# Altium schematic sheet mission_unsleepable.SchDoc
size A2
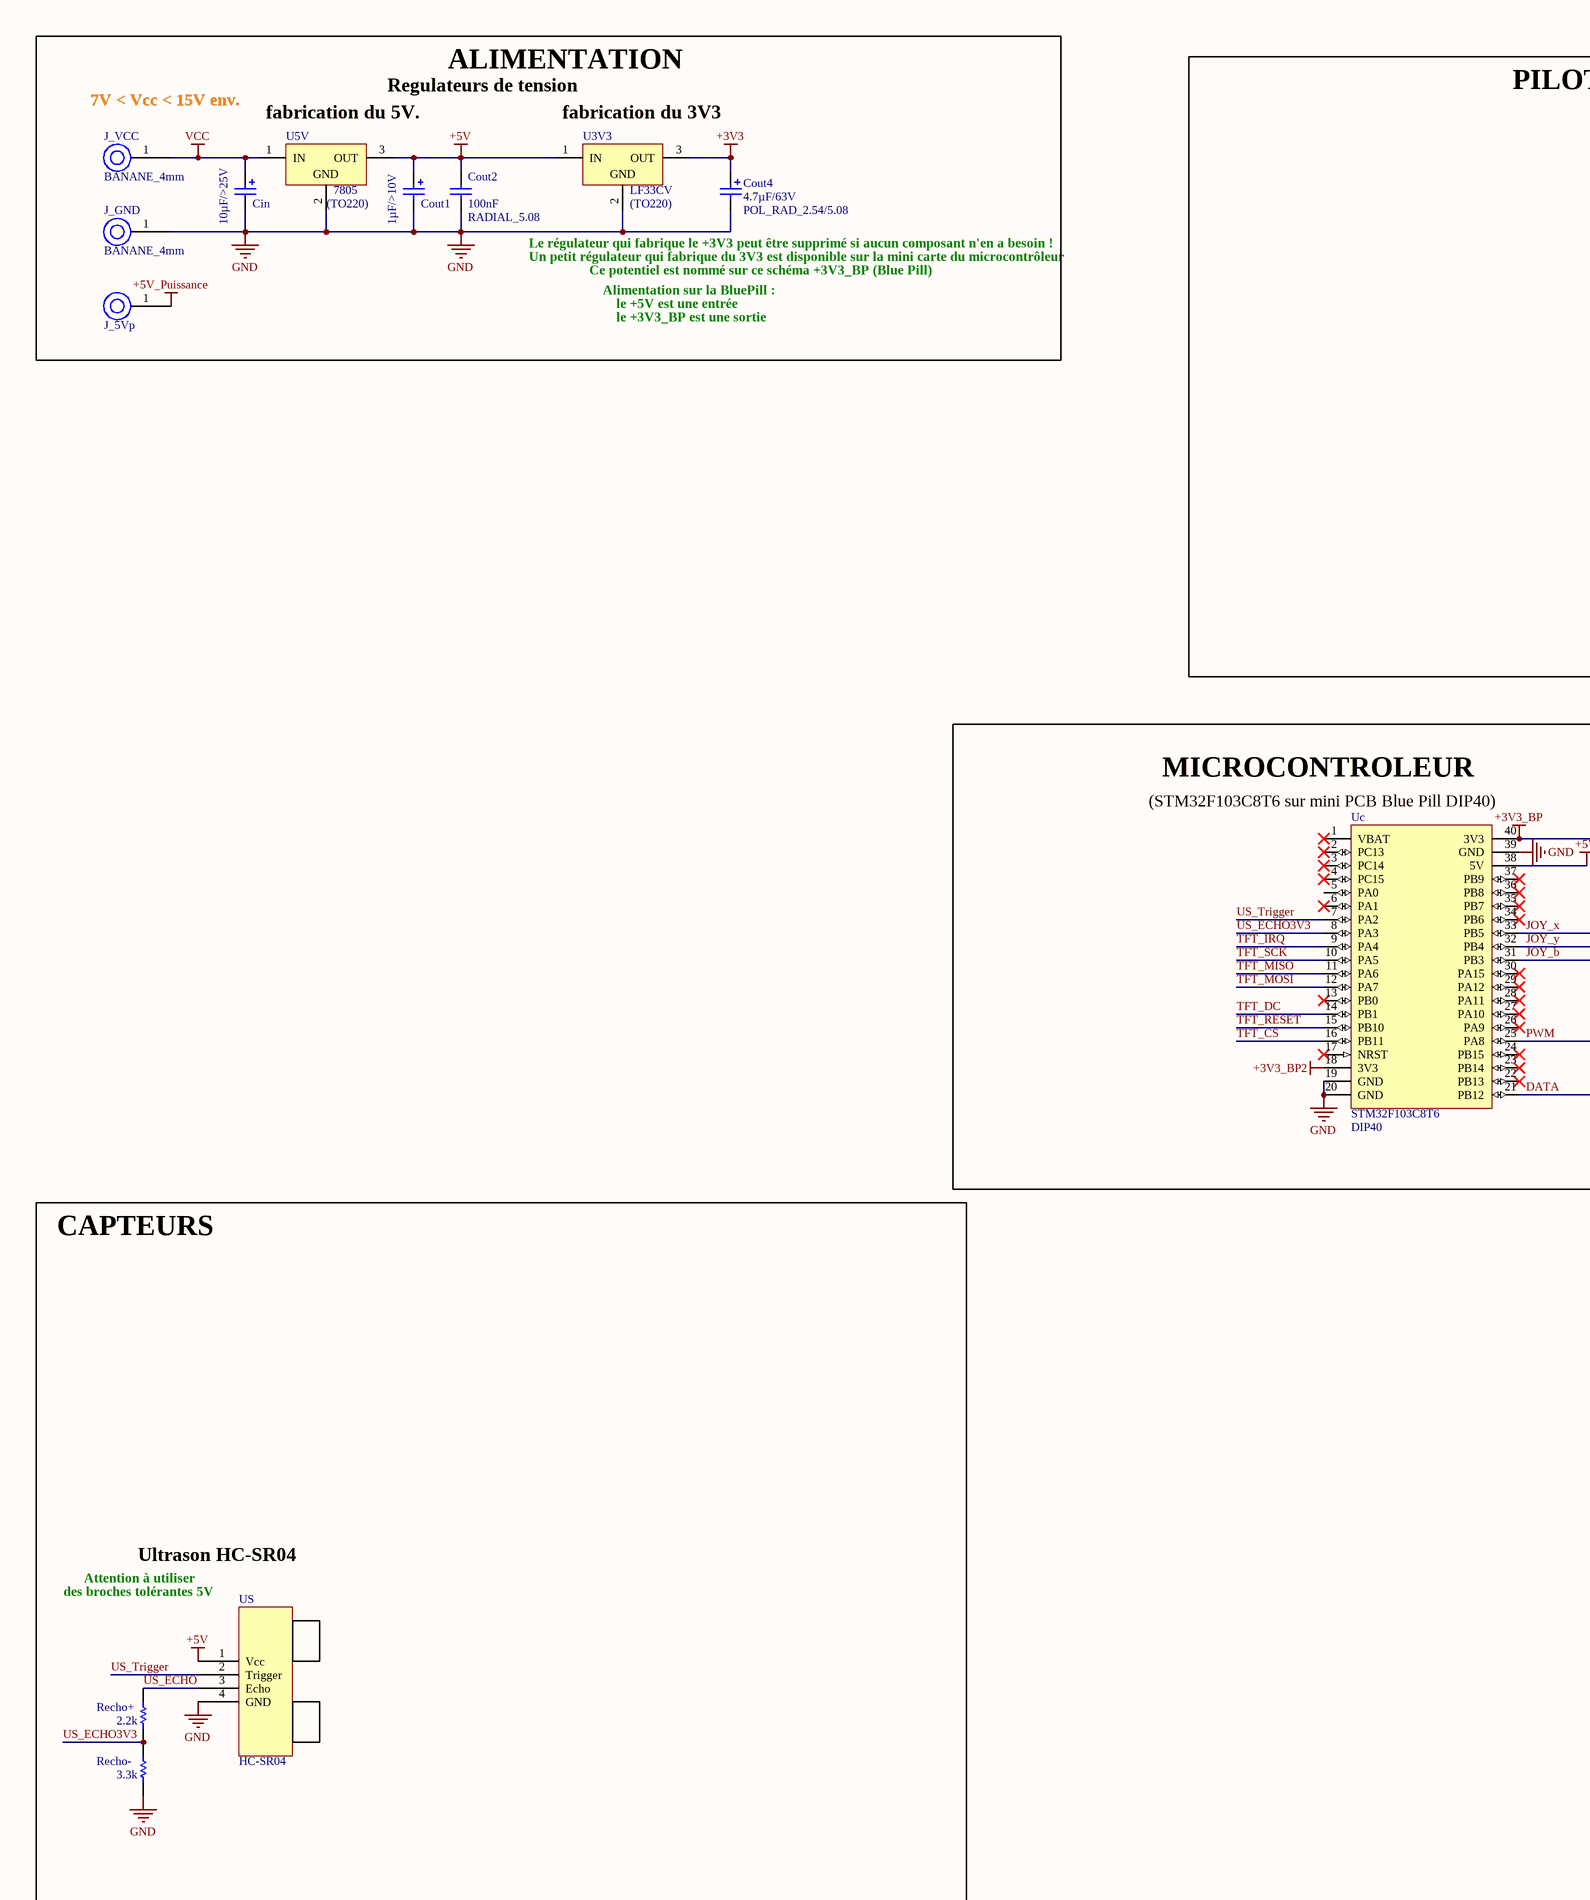
[diagram p0: mission_unsleepable.SchDoc, left]
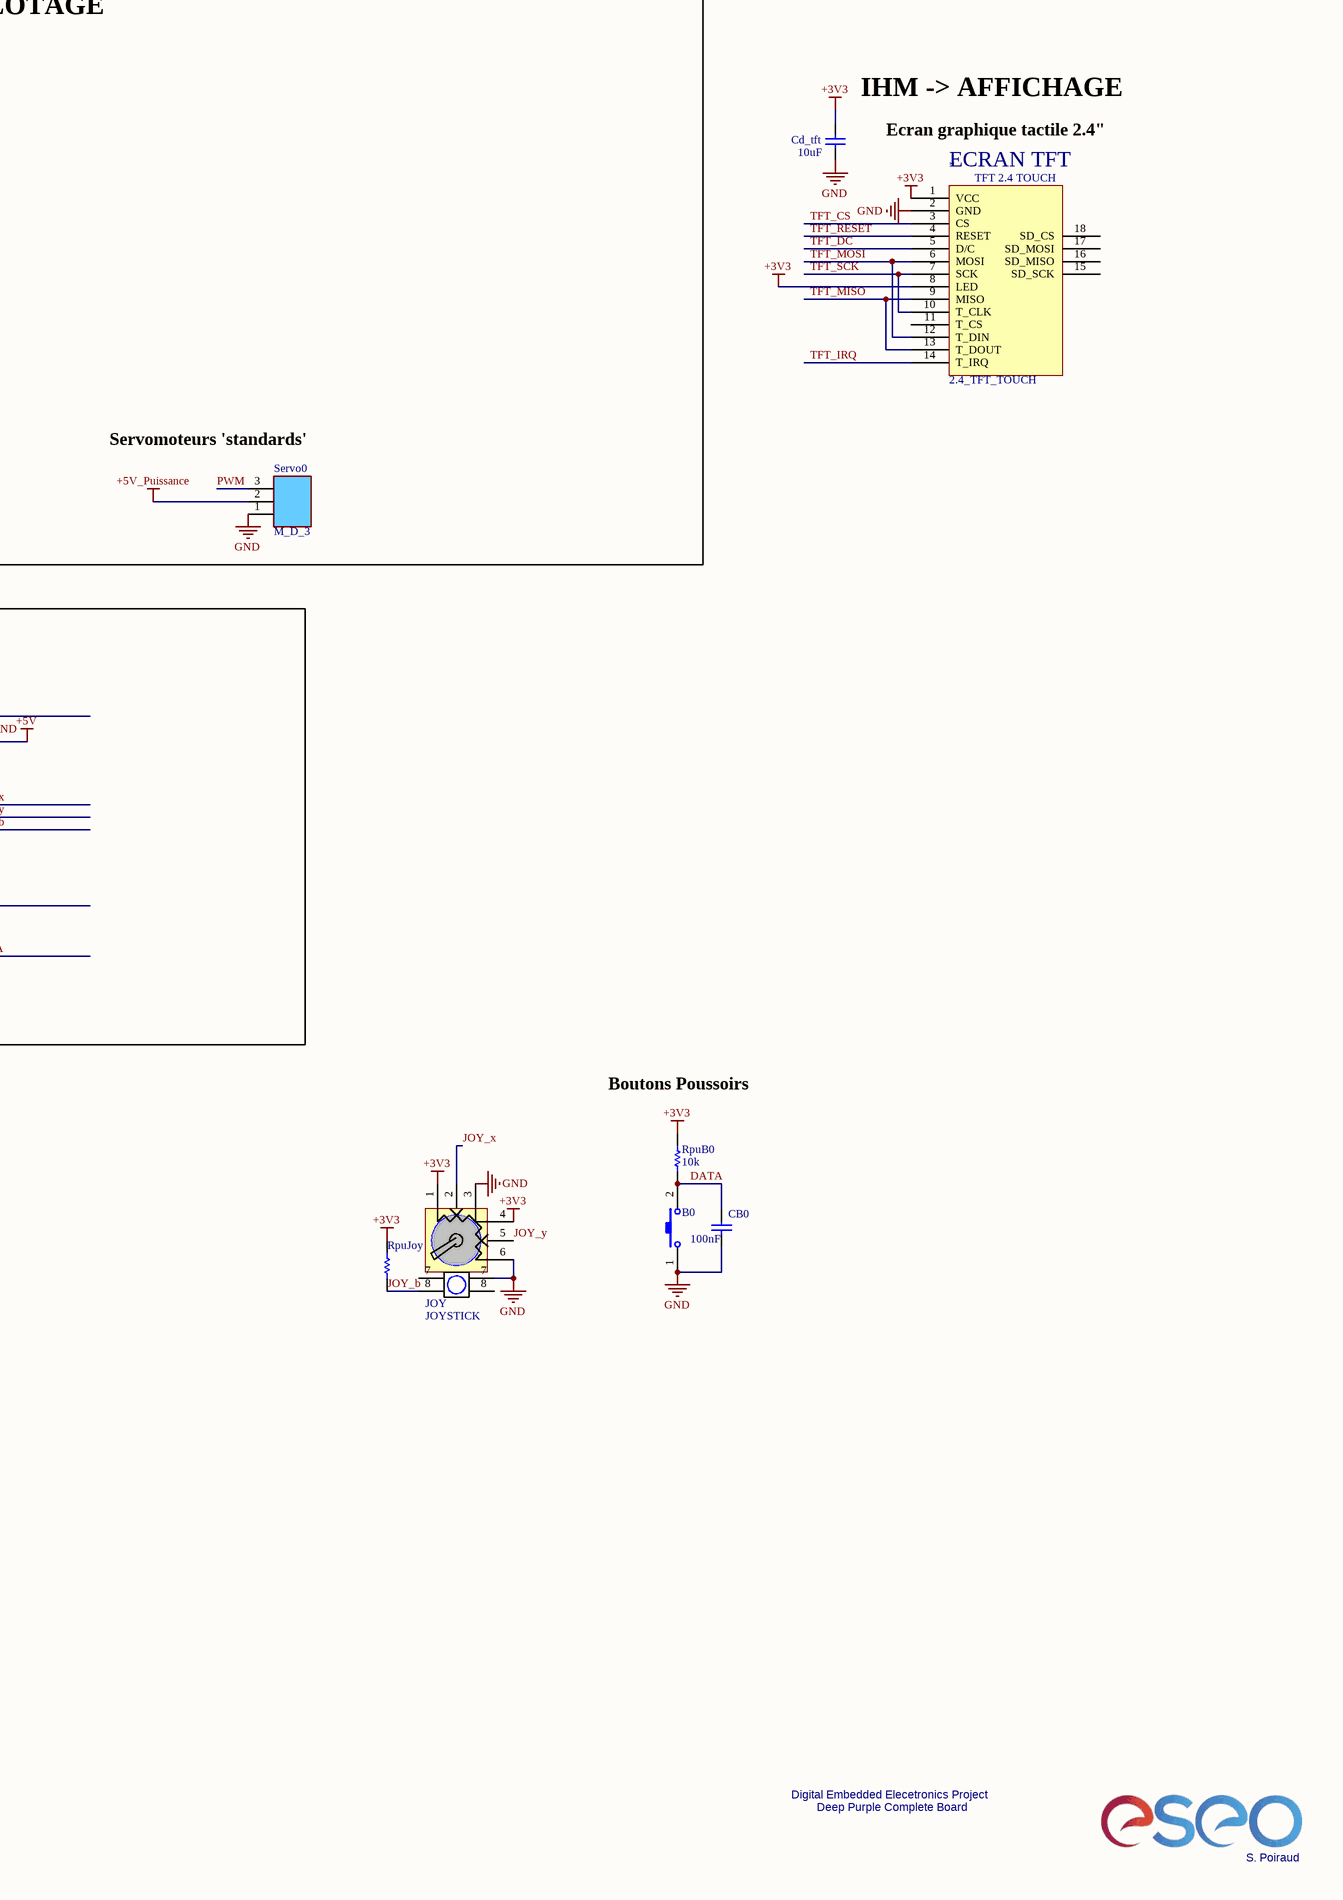
[diagram p1: mission_unsleepable.SchDoc, right]

## Parts
*  2.4_TFT_TOUCH  [2.4_TFT_TOUCH]
B0  BOUTON_POUSSOIR_MINIATURE_TRAVERSANT  [BOUTON_POUSSE_PLAT_6x6]  (value not drawn)
CB0  value 100nF  [C0805_N]  (hidden comment: Condensateur 0805)
Cd_tft  10uF  [CONDENSATEUR_POLARISE_ELECTROLYTIQUE_RADIAL_2.54/5.08]
Cin  value 10µF/>25V  [CONDENSATEUR_POLARISE_ELECTROLYTIQUE_RADIAL_2.0/5.08]  (hidden comment: CONDENSATEUR_POL_ELECTROLY_RAD_2.0/5.08)
Cout1  value 1µF/>10V  [CONDENSATEUR_POLARISE_ELECTROLYTIQUE_RADIAL_2.0/5.08]  (hidden comment: CONDENSATEUR_POL_ELECTROLY_RAD_2.0/5.08)
Cout2  value 100nF  Type: RADIAL_5.08  [CONDENSATEUR_CERAMIQUE_RADIAL_5.08]  (hidden comment: CONDENSATEUR_CER_RAD_5.08)
Cout4  value 4.7µF/63V  Type: POL_RAD_2.54/5.08  [CONDENSATEUR_POLARISE_ELECTROLYTIQUE_RADIAL_2.54/5.08]  (hidden comment: CONDENSATEUR_POL_ELECTROLY_RAD_2.54/5.08)
J_5Vp  DOUILLE BANANE 4mm  [DOUILLE_BANANE_4mm]  (value not drawn)
J_GND  Type: BANANE_4mm  [DOUILLE_BANANE_4mm]  (hidden comment: DOUILLE BANANE 4mm)
J_VCC  Type: BANANE_4mm  [DOUILLE_BANANE_4mm]  (hidden comment: DOUILLE BANANE 4mm)
JOY  Type: JOYSTICK  [JOYSTICK_MINI - avec Switch]  (hidden comment: JOYSTICK_MINI_AVEC_SWITCH)
Recho+  2.2k  [R1206_N]
Recho-  3.3k  [R1206_N]
RpuB0  value 10k  [RESISTANCE_CMS_1206]  (hidden comment: RESISTANCE_CMS_1206)
RpuJoy  RESISTANCE_CMS_1206  [RESISTANCE_CMS_1206]  (value not drawn)
Servo0  Type: M_D_3  [BARRETTE_3_M_D]  (hidden comment: BARRETTE 3 CONTACTS 1 RANGEE MALE DROITE)
U3V3  Type: LF33CV  Package: (TO220)  [REGULATEUR_TO220_78XX]  (hidden comment: REGULATEUR_TO220_78XX)
U5V  Type: 7805  Package: (TO220)  [REGULATEUR_TO220_78XX]  (hidden comment: REGULATEUR_TO220_78XX)
Uc  Type: STM32F103C8T6  Package: DIP40  [STM32F103C8T6_DIP40]  (hidden comment: STM32F103C8T6/PCB_DIP40)
US  HC-SR04  [HC-SR04]

## Blocks framed on the sheet
ALIMENTATION: Cin Cout1 Cout2 Cout4 J_5Vp J_GND J_VCC U3V3 U5V
MICROCONTROLEUR: Uc
CAPTEURS: Recho+ Recho- US

## Nets
+3V3: *.1(VCC) *.8(LED) Cd_tft.1 Cout4.1 JOY.1 JOY.4 RpuB0.2 RpuJoy.2 U3V3.3(OUT)
+3V3_BP: Uc.40(3V3)
+3V3_BP2: Uc.18(3V3)
+5V: Cout1.1 Cout2.2 U3V3.1(IN) U5V.3(OUT) Uc.38(5V) US.1(Vcc)
+5V_Puissance: J_5Vp.1 Servo0.2
GND: *.2(GND) B0.1 CB0.1 Cd_tft.2 Cin.2 Cout1.2 Cout2.1 Cout4.2 J_GND.1 JOY.3 JOY.6 JOY.7 Recho-.1 Servo0.1 U3V3.2(GND) U5V.2(GND) Uc.19(GND) Uc.20(GND) Uc.39(GND) US.4(GND)
VCC: Cin.1 J_VCC.1 U5V.1(IN)
DATA: B0.2 CB0.2 RpuB0.1 Uc.21(PB12)
JOY_b: JOY.8 RpuJoy.1 Uc.31(PB3)
JOY_x: JOY.2 Uc.33(PB5)
JOY_y: JOY.5 Uc.32(PB4)
PWM: Servo0.3 Uc.25(PA8)
TFT_CS: *.3(CS) Uc.16(PB11)
TFT_DC: *.5(D/C) Uc.14(PB1)
TFT_IRQ: *.14(T_IRQ) Uc.9(PA4)
TFT_MISO: *.9(MISO) *.13(T_DOUT) Uc.11(PA6)
TFT_MOSI: *.6(MOSI) *.12(T_DIN) Uc.12(PA7)
TFT_RESET: *.4(RESET) Uc.15(PB10)
TFT_SCK: *.7(SCK) *.10(T_CLK) Uc.10(PA5)
US_ECHO: Recho+.2 US.3(Echo)
US_ECHO3V3: Recho+.1 Recho-.2 Uc.8(PA3)
US_Trigger: Uc.7(PA2) US.2(Trigger)

Not connected (* = marked no-connect by the designer): * 11(T_CS) 15(SD_SCK) 16(SD_MISO) 17(SD_MOSI) 18(SD_CS); Uc 1(VBAT)* 2(PC13)* 3(PC14)* 4(PC15)* 5(PA0) 6(PA1)* 13(PB0)* 17(NRST)* 22(PB13)* 23(PB14)* 24(PB15)* 26(PA9)* 27(PA10)* 28(PA11)* 29(PA12)* 30(PA15)* 34(PB6)* 35(PB7)* 36(PB8)* 37(PB9)*

## Notes on the sheet
- 7V < Vcc < 15V env.
- Regulateurs de tension
- PILOTAGE
- (near U5V) fabrication du 5V.
- (near U3V3) fabrication du 3V3
- Le régulateur qui fabrique le +3V3 peut être supprimé si aucun composant n'en a besoin !
- (near Cd_tft) IHM -> AFFICHAGE
- Ecran graphique tactile 2.4"
- Un petit régulateur qui fabrique du 3V3 est disponible sur la mini carte du microcontrôleur
- Ce potentiel est nommé sur ce schéma +3V3_BP (Blue Pill)
- Alimentation sur la BluePill :
- le +5V est une entrée
- (near *) ECRAN TFT
- le +3V3_BP est une sortie
- (near Servo0) Servomoteurs 'standards'
- (near Uc) (STM32F103C8T6 sur mini PCB Blue Pill DIP40)
- Boutons Poussoirs
- des broches tolérantes 5V
- Attention à utiliser
- Ultrason HC-SR04
- Digital Embedded Elecetronics Project
- Deep Purple Complete Board
- S. Poiraud
- Title
- Size:
- Date:
- File:
- A2
- Number:
- Time:
- Revision:
- Sheet
- of
- (in symbol 2.4_TFT_TOUCH) TFT 2.4 TOUCH

## Library data of the parts
B0 = BOUTON_POUSSOIR_MINIATURE_TRAVERSANT: BOUTON POUSSOIR MINIATURE TRAVERSANT ON/OFF; Type: B_POUSS_MINI_T
CB0 = CONDENSATEUR_CER_RAD_5.08: Type: RADIAL_5.08
Cd_tft = Condensateur: Capacitor; Published: 8-Jun-2000; LatestRevisionDate: 17-Jul-2002; LatestRevisionNote: Re-released for DXP Platform.; PackageReference: RAD-0.3; Publisher: Altium Limited
Cin Cout1 = CONDENSATEUR_POL_ELECTROLY_RAD_2.0/5.08: CONDENSATEUR POLARISE ELECTROLYTIQUE RADIAL 2.0/5.08; Type: POL_RAD_2.0/5.08
Cout2 = CONDENSATEUR_CER_RAD_5.08: CONDENSATEUR TRAVERSANT CERAMIQUE RADIAL 5.08mm
Cout4 = CONDENSATEUR_POL_ELECTROLY_RAD_2.54/5.08: CONDENSATEUR POLARISE ELECTROLYTIQUE RADIAL 2.54/5.08
J_5Vp J_GND J_VCC = DOUILLE_BANANE_4mm: DOUILLE BANANE 4 mm
  J_5Vp: Type: BANANE_4mm
JOY = JOYSTICK_MINI_AVEC_SWITCH: JOYSTICK POTENTIOMETRIQUE MINIATURE RKJXK122000D
Recho+ Recho- = Resistor: Published: 8-Jun-2000; LatestRevisionDate: 17-Jul-2002; LatestRevisionNote: Re-released for DXP Platform.; PackageReference: AXIAL-0.5; Publisher: Altium Limited
RpuB0 = RESISTANCE_CMS_1206: RESISTANCE CMS 1206
RpuJoy = RESISTANCE_CMS_1206: RESISTANCE CMS 1206; Value: 10k; Type: CMS_1206
Servo0 = BARRETTE_3 CONTACTS_1 RANGEE_MALE_DROITE
U3V3 U5V = REGULATEUR_TO220_78XX: REGULATEUR DE TENSION POSITIVE 78XX BOITIER TO220
Uc = STM32F103C8T6/PCB_DIP40: MICROCONTROLEUR 32 BITS - 72MHz - 34 I/O - 64 KO : FLASH - 20KO RAM - 10 CANAUX A/D 12 BITS - DIP40 - UART, SPI, I2C, USB, CAN